# Altium schematic sheet PlanTieV2.SchDoc
size A2; SheetNumber: 1; SheetTotal: 1
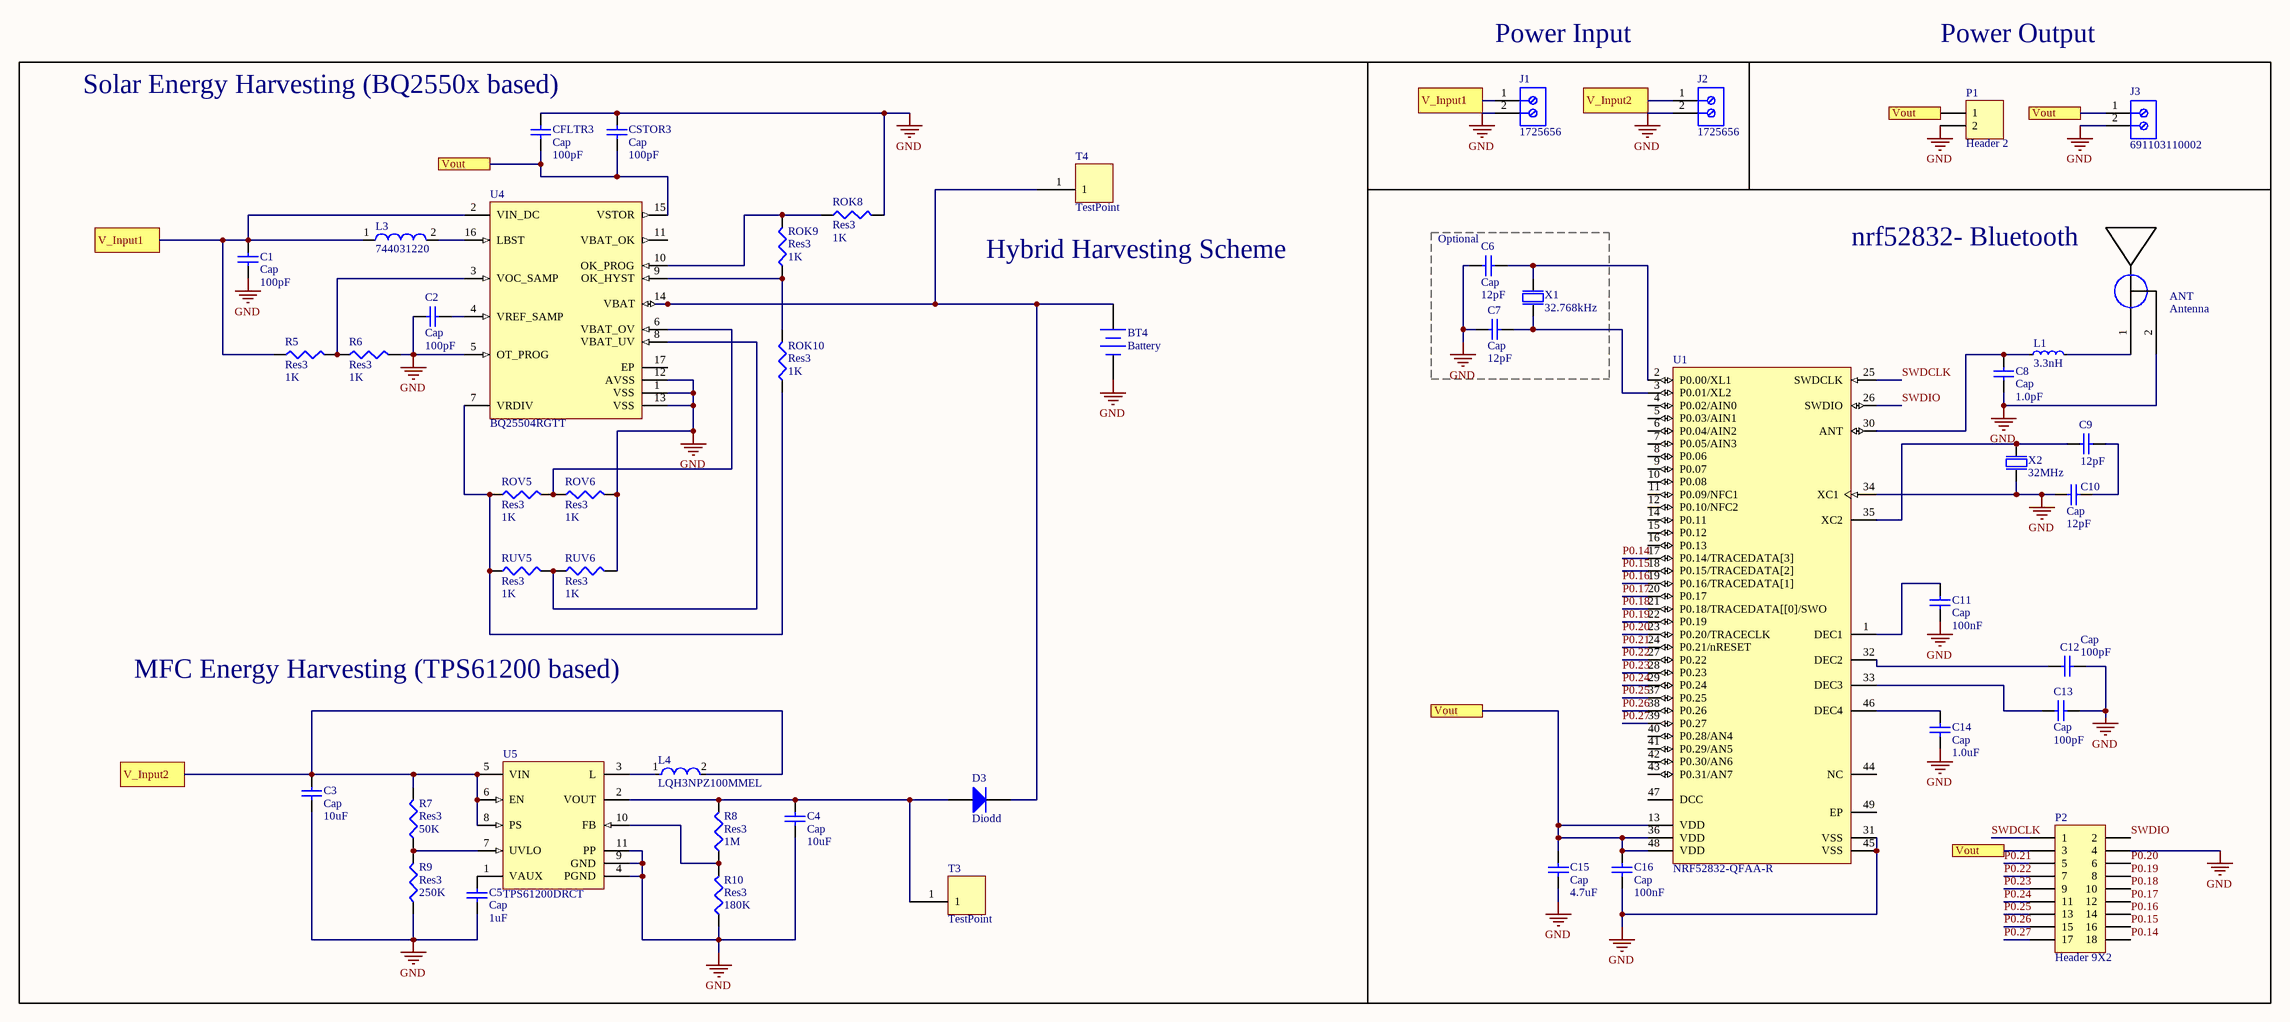
[diagram p0: PlanTieV2.SchDoc]

## Parts
ANT  Antenna  [BT-AFN]
BT4  Battery  [BAT-2]
C1  Cap  value 100pF  [1608[0603]]
C2  Cap  value 100pF  [1608[0603]]
C3  Cap  value 10uF  [1608[0603]]
C4  Cap  value 10uF  [1608[0603]]
C5  Cap  value 1uF  [1608[0603]]
C6  Cap  value 12pF  [1608[0603]]
C7  Cap  value 12pF  [1608[0603]]
C8  Cap  value 1.0pF  [1608[0603]]
C9  value 12pF  [1608[0603]]  (hidden comment: Cap)
C10  Cap  value 12pF  [1608[0603]]
C11  Cap  value 100nF  [1608[0603]]
C12  Cap  value 100pF  [1608[0603]]
C13  Cap  value 100pF  [1608[0603]]
C14  Cap  value 1.0uF  [1608[0603]]
C15  Cap  value 4.7uF  [1608[0603]]
C16  Cap  value 100nF  [1608[0603]]
CFLTR3  Cap  value 100pF  [1608[0603]]
CSTOR3  Cap  value 100pF  [1608[0603]]
D3  Diodd  [DO-41]
J1  1725656  [PHOE-1725656-2]
J2  1725656  [PHOE-1725656-2]
J3  691103110002  [691103110002]
L1  3.3nH  [INDC0603X03L]
L3  744031220  [WE-TPC-3816-S]
L4  LQH3NPZ100MMEL  [FP-LQH3NPH_ME-MFG]
P1  Header 2  [HDR1X2]
P2  Header 9X2  [HDR2X9]
R5  Res3  value 1K  [J1-0603]
R6  Res3  value 1K  [J1-0603]
R7  Res3  value 50K  [J1-0603]
R8  Res3  value 1M  [J1-0603]
R9  Res3  value 250K  [J1-0603]
R10  Res3  value 180K  [J1-0603]
ROK8  Res3  value 1K  [J1-0603]
ROK9  Res3  value 1K  [J1-0603]
ROK10  Res3  value 1K  [J1-0603]
ROV5  Res3  value 1K  [J1-0603]
ROV6  Res3  value 1K  [J1-0603]
RUV5  Res3  value 1K  [J1-0603]
RUV6  Res3  value 1K  [J1-0603]
T3  TestPoint  [PIN1]
T4  TestPoint  [PIN1]
U1  NRF52832-QFAA-R  [NRSC-QF-48_M]
U4  BQ25504RGTT  [RGT0016C_V]
U5  TPS61200DRCT  [DRC0010J_V]
X1  32.768kHz  [XTAL_2012]
X2  32MHz  [BT-XTAL_2016]

## Blocks framed on the sheet
Power Input: J1 J2
Power Output: J3 P1
nrf52832- Bluetooth: ANT C8-C16 L1 P2 U1 X2
Optional: C6 C7 X1

## Ports
V_Input1, V_Input2, Vout

## Nets
GND: ANT.2 BT4.2(-) C1.1 C2.1 C3.1 C4.1 C5.1 C6.2 C7.2 C8.2 C10.2 C11.2 C12.2 C13.1 C14.2 C15.2 C16.2 CFLTR3.2 CSTOR3.2 J1.2 J2.2 J3.2 P1.2 P2.4 R6.2 R9.1 R10.1 ROK8.2 ROV6.2 RUV6.2 U1.31(VSS) U1.34(XC1) U1.45(VSS) U4.1(VSS) U4.5(OT_PROG) U4.12(AVSS) U4.13(VSS) U5.4(PGND) U5.9(GND) U5.11(PP) X2.1(inp) X2.2(GND) X2.4(GND)
P0.14: P2.18 U1.17(P0.14/TRACEDATA[3])
P0.15: P2.16 U1.18(P0.15/TRACEDATA[2])
P0.16: P2.14 U1.19(P0.16/TRACEDATA[1])
P0.17: P2.12 U1.20(P0.17)
P0.18: P2.10 U1.21(P0.18/TRACEDATA[[0]/SWO)
P0.19: P2.8 U1.22(P0.19)
P0.20: P2.6 U1.23(P0.20/TRACECLK)
P0.21: P2.5 U1.24(P0.21/nRESET)
P0.22: P2.7 U1.27(P0.22)
P0.23: P2.9 U1.28(P0.23)
P0.24: P2.11 U1.29(P0.24)
P0.25: P2.13 U1.37(P0.25)
P0.26: P2.15 U1.38(P0.26)
P0.27: P2.17 U1.39(P0.27)
SWDCLK: P2.1 U1.25(SWDCLK)
SWDIO: P2.2 U1.26(SWDIO)
V_Input1: C1.2 J1.1 L3.1 R5.1 U4.2(VIN_DC) ; port V_Input1
V_Input2: C3.2 J2.1 L4.2 R7.2 U5.5(VIN) U5.6(EN) U5.8(PS) ; port V_Input2
Vout: C15.1 C16.1 CFLTR3.1 CSTOR3.1 J3.1 P1.1 P2.3 U1.13(VDD) U1.36(VDD) U1.48(VDD) U4.15(VSTOR) ; port Vout
NetANT_1: ANT.1 L1.2
NetBT4_1: BT4.1(+) D3.2(K) T4.1 U4.14(VBAT)
NetC2_2: C2.2 U4.4(VREF_SAMP)
NetC4_2: C4.2 D3.1(A) R8.2 T3.1 U5.2(VOUT)
NetC5_2: C5.2 U5.1(VAUX)
NetC6_1: C6.1 U1.2(P0.00/XL1) X1.1(inp)
NetC7_1: C7.1 U1.3(P0.01/XL2) X1.2(out)
NetC8_1: C8.1 L1.1 U1.30(ANT)
NetC9_1: C9.1 C10.1
NetC9_2: C9.2 U1.35(XC2) X2.3(out)
NetC11_1: C11.1 U1.1(DEC1)
NetC12_1: C12.1 U1.32(DEC2)
NetC13_2: C13.2 U1.33(DEC3)
NetC14_1: C14.1 U1.46(DEC4)
NetL3_2: L3.2 U4.16(LBST)
NetL4_1: L4.1 U5.3(L)
NetR5_2: R5.2 R6.1 U4.3(VOC_SAMP)
NetR7_1: R7.1 R9.2 U5.7(UVLO)
NetR8_1: R8.1 R10.2 U5.10(FB)
NetROK8_1: ROK8.1 ROK9.2 U4.10(OK_PROG)
NetROK9_1: ROK9.1 ROK10.2 U4.9(OK_HYST)
NetROK10_1: ROK10.1 ROV5.1 RUV5.1 U4.7(VRDIV)
NetROV5_2: ROV5.2 ROV6.1 U4.6(VBAT_OV)
NetRUV5_2: RUV5.2 RUV6.1 U4.8(VBAT_UV)

Not connected (* = marked no-connect by the designer): U1 4(P0.02/AIN0) 5(P0.03/AIN1) 6(P0.04/AIN2) 7(P0.05/AIN3) 8(P0.06) 9(P0.07) 10(P0.08) 11(P0.09/NFC1) 12(P0.10/NFC2) 14(P0.11) 15(P0.12) 16(P0.13) 40(P0.28/AN4) 41(P0.29/AN5) 42(P0.30/AN6) 43(P0.31/AN7) 44(NC) 47(DCC) 49(EP); U4 11(VBAT_OK) 17(EP)

## Notes on the sheet
- Solar Energy Harvesting (BQ2550x based)
- Hybrid Harvesting Scheme
- MFC Energy Harvesting (TPS61200 based)

## Library data of the parts
BT4 = Battery: Multicell Battery; Published: 24-Mar-1999; LatestRevisionDate: 17-Jul-2002; LatestRevisionNote: Re-released for DXP Platform.; PackageReference: BAT-2; Publisher: Altium Limited; PackageDescription: Battery; 2 Leads
C1-C16 CFLTR3 CSTOR3 = Cap: Capacitor; Published: 8-Jun-2000; LatestRevisionDate: 17-Jul-2002; LatestRevisionNote: Re-released for DXP Platform.; PackageReference: RAD-0.3; Publisher: Altium Limited; PackageDescription: Radial Cap, Thru-Hole; 2 Leads; 0.3 in Pin Spacing
D3 = Diode 1N4934: 1 Amp Fast Recovery Rectifier; Published: 8-Jun-2000; LatestRevisionDate: 17-Jul-2002; LatestRevisionNote: Re-released for DXP Platform.; DatasheetVersion: 1999; PackageVersion: Aug-1999; PackageReference: DO-41; Publisher: Altium Limited; PackageDescription: Diode, Axial; Body 5.2 x 2.7 mm (LxDia. max), Lead Dia. 0.86 mm (max); Code_JEDEC: DO-204-AL; ComponentLink1Description: Manufacturer Link; ComponentLink1URL: http://www.fairchildsemi.com/; ComponentLink2Description: Datasheet; ComponentLink2URL: http://www.fairchildsemi.com/ds/1N%2F1N4934.pdf
J1 J2 = CMP-2000-05299-1: Male Header, Pitch 2.54 mm, 1 x 2 Position, Height 9 mm, Tail Length 3.5 mm; Manufacturer: Phoenix Contact; Number of contacts: 2; Content: 250pc(s); Pitch: 2.54mm; Industrial packaging: Yes; Colour: Green; Manufacturer part No.: 1725656; Type: MPT0,5/2-2,54; Datasheet URL: http://datasheet.octopart.com/1725656-Phoenix-Contact-datasheet-5302866.pdf; Manufacturer URL: http://www.phoenixcontact.com/; Datasheet Version: Apr-08
J3 = CMP-1502-03254-1: Series 1031 - 3.50 mm Horizontal Entry Modular with Pressure Clamp WR-TBL, 2 pin; Manufacturer: Wurth Elektronik; Pin Number: 2; Pitch: 3.50mm; Datasheet URL: http://katalog.we-online.de/em/datasheet/6911031100xx.pdf; Package Reference: 691103110002; Publisher: WurthElektronik; Manufacturer URL: http://www.we-online.de; Mounting Technology: THT; Operating Temperature: -40to105degC; Part Number: 691103110002; Packaging: Box
L1 = L0201-3n3: High frequency chip inductor ±5%; Artikkelnr Noca: N.A.; Part Number: L0201-3n3; Manufacturer: *; Manufacturer Part Number: *; Datasheet: *; LatestRevisionDate: 2013-04-10; Pin Count: 2; Publisher: Nordic Semiconductor; Published: 2013-04-10; Value: 3.3nH; Note: High frequency chip inductor ±5%; Supplier: *; Supplier part number: *; 2nd source Supplier: *; 2nd source part number: *; Footprint Doc: 0201; Artikkelnr Simpro: N.A.
L3 = CMP-0227-00346-1: SMD Shielded Tiny Power Inductor WE-TPC, L = 22.0 µH; Inductance: 22.0 ÂµH; ComponentLink1URL: http://www.we-online.com; PackageReference: WE-TPC-3816-S; ComponentLink1Description: Manufacturer Link; PackageVersion: 2009; ComponentLink2URL: http://www.we-online.de/katalog/media/pdf/744031220.pdf; PackageDescription: SMD Inductor, 2-Leads, Body 3.8 x 3.8 mm; ComponentLink2Description: Datasheet; DatasheetVersion: ver 6, Jan-2009
L4 = CMP-06042-007129-1: Wire Wound Ferrite Inductor for Power Lines For Automotive 10μH ±20% 0.228Ω 1280mA 1212; Self Resonant Frequency: 20MHz; Inductance: 10uH; Test Frequency: 1MHz; Shielding: Shielded; Saturation Current: 810mA; DC Resistance (DCR): 228mR; Current Rating: 1.28A; Case Code (Imperial): 1212; Case Code (Metric): 3030; Core Material: Ferrite; Resistor Type: Wirewound; Mount: Surface Mount; Ratings: AEC-Q200; Packaging: Cut Tape; Max Operating Temperature: 85°C; Tolerance: 20%; Min Operating Temperature: -40°C; Case/Package: 1212
P1 = Header 2: Header, 2-Pin; LatestRevisionDate: 17-Jul-2002; LatestRevisionNote: Re-released for DXP Platform.; Publisher: Altium Limited
P2 = Header 9X2: Header, 9-Pin, Dual row; LatestRevisionDate: 17-Jul-2002; LatestRevisionNote: Re-released for DXP Platform.; Publisher: Altium Limited
R5-R10 ROK8-ROK10 ROV5 ROV6 RUV5 RUV6 = Res3: Resistor; Published: 8-Jun-2000; LatestRevisionDate: 29-May-2009; LatestRevisionNote: IPC-7351 Footprint Added.; PackageReference: J1-0603; Publisher: Altium Limited; PackageDescription: Chip Resistor
U1 = CMP-2100-03661-1: Multiprotocol Bluetooth Smart, ANT/ANT+ and Proprietary System-on-Chip, 2.4 GHz, 256 KB FLASH, 1.7 to 3.6 V, -40 to 85 degC, 48-Pin QFN, RoHS, Tape and Reel; Manufacturer: Nordic Semiconductor; Frequency: 2.4GHz; Datasheet Version: Rev. 1.0, 02/2016; Datasheet URL: http://infocenter.nordicsemi.com/pdf/nRF52832_PS_v1.0.pdf; Mount: SurfaceMount; Max Operating Temperature: 85degC; Manufacturer URL: http://www.nordicsemi.com/eng/Products/; Lead Free: LeadFree; Min Operating Temperature: -40degC; RoHSCompliant: true; Package Reference: QF-48; Package Description: 48-Pin Quad Flat No-lead Package, Body 6 x 6 mm, Pitch 0.4 mm, Thermal Pad 4.6 x 4.6 mm; Max Frequency: 2.4GHz; Packaging: TapeandReel
U4 = CMP-0321-00258-2: Ultra Low Power Boost Converter with Battery Management for Energy Harvester App, 0.13 V, -40 to 85 degC, 16-pin QFN (RGT), Green (RoHS & no Sb/Br); Manufacturer: Texas Instruments; Li-Ion: N; SubFamily: Battery Charge Management; Vin(Min)(V): 0.13; ComponentLink1URL: http://www.ti.com/general/docs/lit/getliterature.tsp?genericPartNumber=BQ25504&fileType=pdf; ComponentLink1Description: Datasheet; PartNumber: BQ25504RGTT; DatasheetVersion: SLUSAH0; PackageVersion: revH, Oct-2011; Lead Acid: N; PackageDescription: 16-Pin Plastic Quad Flat No-Lead, 3 x 3 mm Body, 0.5 mm Pitch, 1.7 x 1.7 mm Exposed Pad; Mounting Technology: Surface Mount; Eco-Plan: Green (RoHS & no Sb/Br); NiMH: N; PackageReference: RGT0016C; Over Voltage Protection: N; Li-Polymer: N; NiCd: N; Code_JEDEC: MO-220
U5 = CMP-0347-00023-2: Boost Voltage Converter with 0.3 to 5.5 V Input and 1.8 to 5.5 V Output, -40 to 85 degC, 10-Pin SON (DRC), Green (RoHS & no Sb/Br); Manufacturer: Texas Instruments; Vout(Min)(V): 1.8; SubFamily: Step-Up Regulator; Vin(Min)(V): 0.3; Vout(Max)(V): 5.5; Switching Frequency(Max)(kHz): 1250; Regulated Outputs(#): 1; Synchronous Rectification: TRUE; Mounting Technology: Surface Mount; Eco-Plan: Green (RoHS & no Sb/Br); DatasheetVersion: SLVS577B; ComponentLink1Description: Datasheet; PartNumber: TPS61200DRCT; Topology: Boost; PackageVersion: revL, Sep-2011; ComponentLink1URL: http://www.ti.com/general/docs/lit/getliterature.tsp?genericPartNumber=TPS61200&fileType=pdf; PackageDescription: 10-Pin Plastic Small Outline No-Lead, 3 x 3 x 1 mm Body, 0.5 mm Pitch, Exposed Pad; PackageReference: DRC0010J; Vin(Max)(V): 5.5; ComponentLink2Description: Package Specification; ComponentLink2URL: http://www.ti.com/litv/pdf/mpds117k
X1 = XTAL_SMD2012_32.768kHz_9pF_Seiko: XTAL SMD 2012, 32.768kHz, Cl=9pF, Total Tol: ±50ppm; Manufacturer: Seiko; Manufacturer Part Number: SC20S-9.0PF20PPM; Note: XTAL SMD 32.768kHz, 2012; Artikkelnr Noca: N.A.; Part Number: XTAL_SMD2012_32.768kHz_9pF_Seiko; Datasheet: http://www.sii.co.jp/en/quartz/files/2013/03/file_PRODUCT_MASTER_50811_GRAPHIC03.pdf; LatestRevisionDate: 2015-10-15; Pin Count: 2; Publisher: Nordic Semiconductor; Published: 2015-10-15; Value: 32.768kHz; Supplier: *; Supplier part number: *; 2nd source Supplier: *; 2nd source part number: *; Footprint Doc: XTAL_2012; Artikkelnr Simpro: N.A.
X2 = XTAL_SMD2016_32MHz_8pF_Epson: XTAL SMD 2016, 32MHz, Cl=8pF, Total Tol: ±40ppm; Manufacturer: Epson Toyocom; Manufacturer Part Number: Q22FA12800025; Note: XTAL SMD 32.000MHz; Artikkelnr Noca: N.A.; Part Number: XTAL_SMD2016_32MHz_8pF_Epson; Datasheet: http://www.epsondevice.com/docs/qd/en/DownloadServlet?id=ID000449; LatestRevisionDate: 2014-11-27; Pin Count: 4; Publisher: Nordic Semiconductor; Published: 2012-03-09; Value: 32MHz; Supplier: Farnell; Supplier part number: 171-2806; 2nd source Supplier: *; 2nd source part number: *; Footprint Doc: XTAL_2016; Artikkelnr Simpro: N.A.